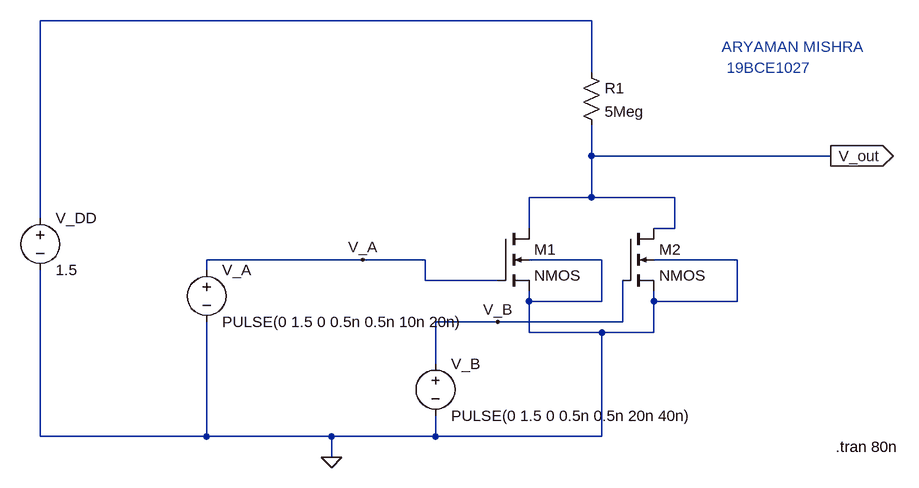
[diagram p0: schematic exp7_task3_1.asc]
exp7_task3_1.asc, the LTspice schematic file:
Version 4
SHEET 1 880 680
WIRE 352 -176 -496 -176
WIRE 352 -96 352 -176
WIRE 352 32 352 -16
WIRE 720 32 352 32
WIRE 352 96 352 32
WIRE 352 96 256 96
WIRE 480 96 352 96
WIRE -496 128 -496 -176
WIRE 256 144 256 96
WIRE 480 144 480 96
WIRE 480 144 448 144
WIRE 0 192 -240 192
WIRE 96 192 0 192
WIRE 368 192 256 192
WIRE 576 192 448 192
WIRE -240 208 -240 192
WIRE 96 224 96 192
WIRE 208 224 96 224
WIRE 256 256 256 240
WIRE 368 256 368 192
WIRE 368 256 256 256
WIRE 448 256 448 240
WIRE 576 256 576 192
WIRE 576 256 448 256
WIRE 208 288 112 288
WIRE 400 288 400 224
WIRE 400 288 208 288
WIRE 256 304 256 256
WIRE 368 304 256 304
WIRE 448 304 448 256
WIRE 448 304 368 304
WIRE 112 352 112 288
WIRE -496 464 -496 208
WIRE -240 464 -240 288
WIRE -240 464 -496 464
WIRE -48 464 -240 464
WIRE 112 464 112 432
WIRE 112 464 -48 464
WIRE 368 464 368 304
WIRE 368 464 112 464
WIRE -48 496 -48 464
FLAG 720 32 V_out
IOPIN 720 32 Out
FLAG 0 192 V_A
FLAG 208 288 V_B
FLAG -48 496 0
SYMBOL nmos4 208 144 R0
SYMATTR InstName M1
SYMBOL nmos4 400 144 R0
SYMATTR InstName M2
SYMBOL res 336 -112 R0
SYMATTR InstName R1
SYMATTR Value 5Meg
SYMBOL voltage -496 112 R0
WINDOW 123 0 0 Left 0
WINDOW 39 0 0 Left 0
SYMATTR InstName V_DD
SYMATTR Value 1.5
SYMBOL voltage -240 192 R0
WINDOW 123 0 0 Left 0
WINDOW 39 0 0 Left 0
SYMATTR InstName V_A
SYMATTR Value PULSE(0 1.5 0 0.5n 0.5n 10n 20n)
SYMBOL voltage 112 336 R0
WINDOW 123 0 0 Left 0
WINDOW 39 0 0 Left 0
SYMATTR InstName V_B
SYMATTR Value PULSE(0 1.5 0 0.5n 0.5n 20n 40n)
TEXT 728 480 Left 2 !.tran 80n
TEXT 560 -104 Left 2 ;19BCE1027
TEXT 552 -136 Left 2 ;ARYAMAN MISHRA

The netlist it stands for:
* exp7_task3_1.asc
M1 V_out V_A 0 0 NMOS
M2 V_out V_B 0 0 NMOS
R1 N001 V_out 5Meg
V_DD N001 0 1.5
V_A V_A 0 PULSE(0 1.5 0 0.5n 0.5n 10n 20n)
V_B V_B 0 PULSE(0 1.5 0 0.5n 0.5n 20n 40n)
.model NMOS NMOS
.model PMOS PMOS
.lib standard.mos
.tran 80n
* 19BCE1027
* ARYAMAN MISHRA
.backanno
.end

* Results of the author's LTspice run, read from the files saved beside the schematic
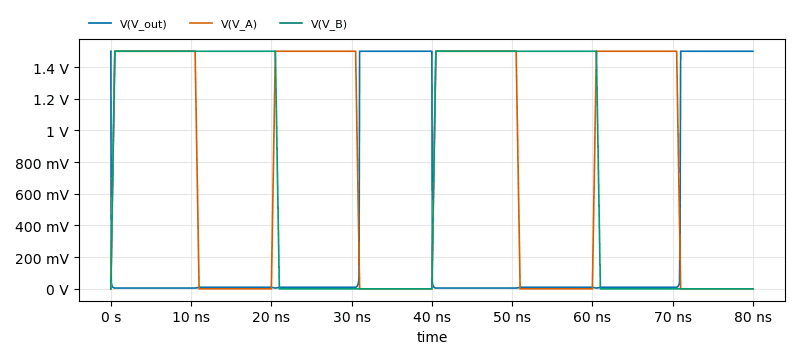
[diagram p1: Transient Analysis of exp7_task3_1.asc, plotted from the saved traces]
* Transient Analysis, 1 run:
*   V(V_out): min 4.992 mV, max 1.5 V, average 347 mV, rms 713.9 mV, last 1.5 V
*   V(V_A): min 0 V, max 1.5 V, average 787.5 mV, rms 1.078 V, last 0 V
*   V(V_B): min 0 V, max 1.5 V, average 768.7 mV, rms 1.07 V, last 0 V